# EAGLE design DualNixie (EAGLE 7.4.0)
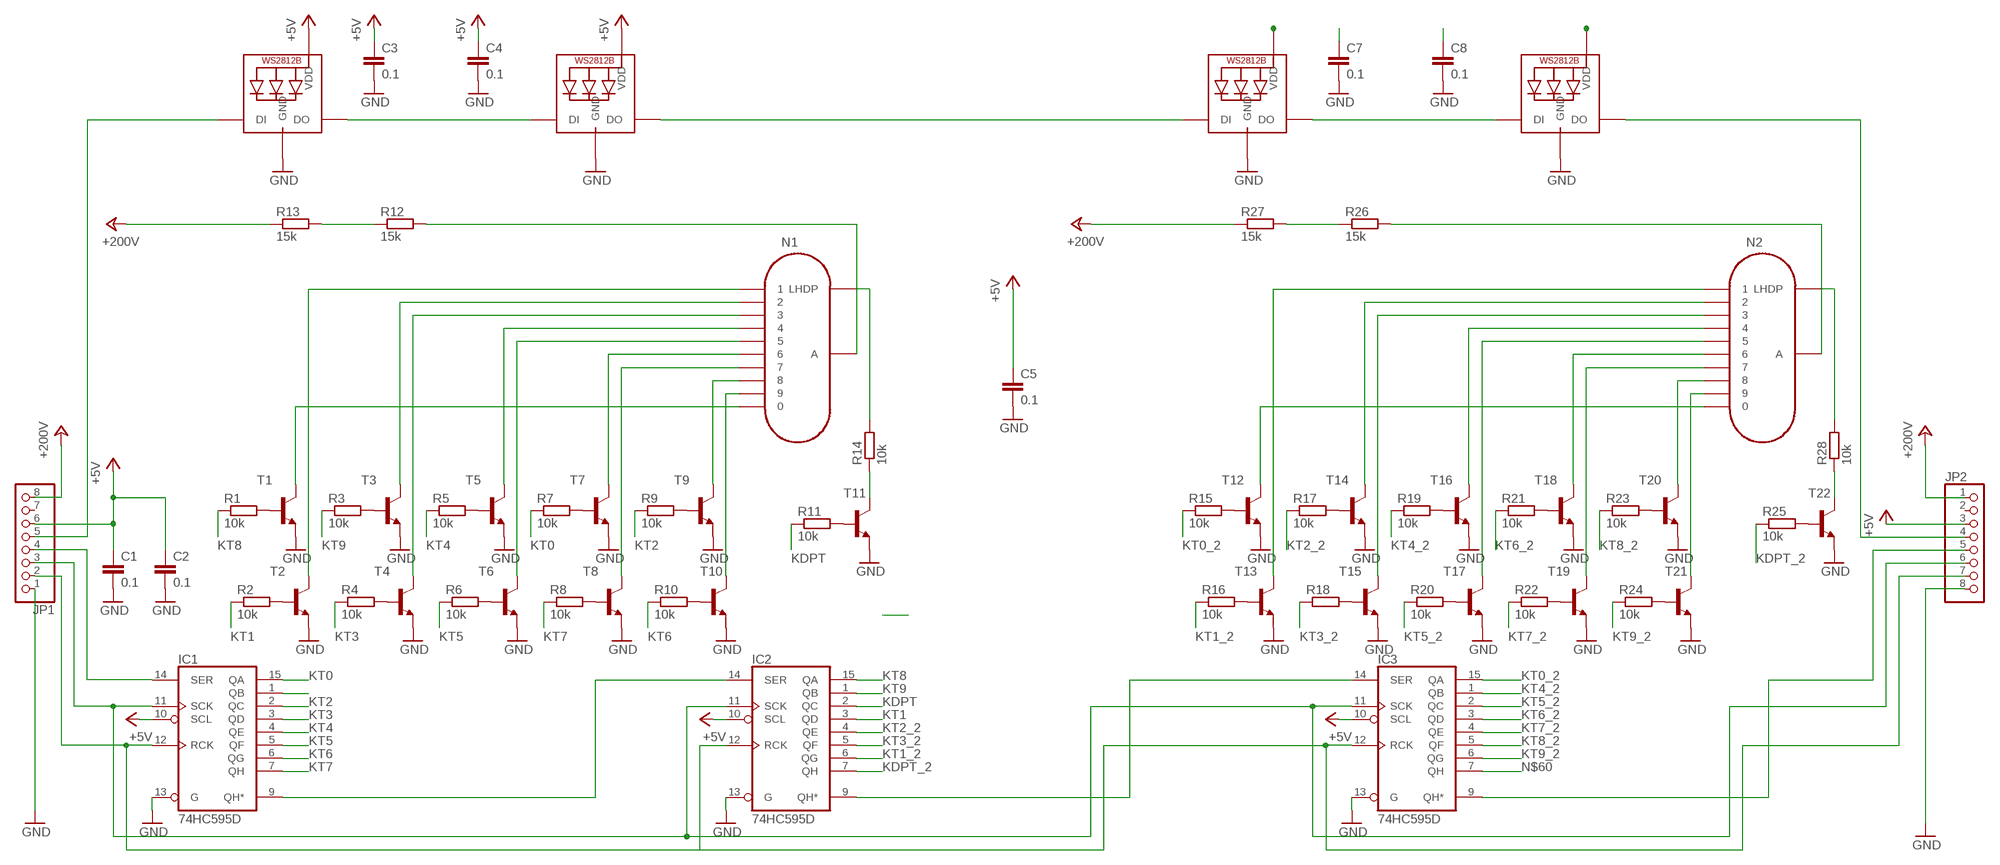
[diagram p0: schematic, sheet 1]

## Parts
C1  0.1  C-EUC0805  [C0805]
C2  0.1  C-EUC0805  [C0805]
C3  0.1  C-EUC0805  [C0805]
C4  0.1  C-EUC0805  [C0805]
C5  0.1  C-EUC0805  [C0805]
C7  0.1  C-EUC0805  [C0805]
C8  0.1  C-EUC0805  [C0805]
IC1  74HC595D  [SO16]
IC2  74HC595D  [SO16]
IC3  74HC595D  [SO16]
JP1  HEADER-1X8ROUND  [1X08_ROUND]
JP2  HEADER-1X8ROUND  [1X08_ROUND]
LED1  WS2812B3535  [LED3535]
LED2  WS2812B3535  [LED3535]
LED3  WS2812B3535  [LED3535]
LED4  WS2812B3535  [LED3535]
N1  IN-12B1.5MM  [IN-12-1.5]
N2  IN-12B1.5MM  [IN-12-1.5]
R1  10k  R-EU_R0805  [R0805]
R2  10k  R-EU_R0805  [R0805]
R3  10k  R-EU_R0805  [R0805]
R4  10k  R-EU_R0805  [R0805]
R5  10k  R-EU_R0805  [R0805]
R6  10k  R-EU_R0805  [R0805]
R7  10k  R-EU_R0805  [R0805]
R8  10k  R-EU_R0805  [R0805]
R9  10k  R-EU_R0805  [R0805]
R10  10k  R-EU_R0805  [R0805]
R11  10k  R-EU_R0805  [R0805]
R12  15k  R-EU_R0805  [R0805]
R13  15k  R-EU_R0805  [R0805]
R14  10k  R-EU_R0805  [R0805]
R15  10k  R-EU_R0805  [R0805]
R16  10k  R-EU_R0805  [R0805]
R17  10k  R-EU_R0805  [R0805]
R18  10k  R-EU_R0805  [R0805]
R19  10k  R-EU_R0805  [R0805]
R20  10k  R-EU_R0805  [R0805]
R21  10k  R-EU_R0805  [R0805]
R22  10k  R-EU_R0805  [R0805]
R23  10k  R-EU_R0805  [R0805]
R24  10k  R-EU_R0805  [R0805]
R25  10k  R-EU_R0805  [R0805]
R26  15k  R-EU_R0805  [R0805]
R27  15k  R-EU_R0805  [R0805]
R28  10k  R-EU_R0805  [R0805]
T1  MMBTA42LT1-NPN-SOT23-BEC  [SOT23-BEC]
T2  MMBTA42LT1-NPN-SOT23-BEC  [SOT23-BEC]
T3  MMBTA42LT1-NPN-SOT23-BEC  [SOT23-BEC]
T4  MMBTA42LT1-NPN-SOT23-BEC  [SOT23-BEC]
T5  MMBTA42LT1-NPN-SOT23-BEC  [SOT23-BEC]
T6  MMBTA42LT1-NPN-SOT23-BEC  [SOT23-BEC]
T7  MMBTA42LT1-NPN-SOT23-BEC  [SOT23-BEC]
T8  MMBTA42LT1-NPN-SOT23-BEC  [SOT23-BEC]
T9  MMBTA42LT1-NPN-SOT23-BEC  [SOT23-BEC]
T10  MMBTA42LT1-NPN-SOT23-BEC  [SOT23-BEC]
T11  MMBTA42LT1-NPN-SOT23-BEC  [SOT23-BEC]
T12  MMBTA42LT1-NPN-SOT23-BEC  [SOT23-BEC]
T13  MMBTA42LT1-NPN-SOT23-BEC  [SOT23-BEC]
T14  MMBTA42LT1-NPN-SOT23-BEC  [SOT23-BEC]
T15  MMBTA42LT1-NPN-SOT23-BEC  [SOT23-BEC]
T16  MMBTA42LT1-NPN-SOT23-BEC  [SOT23-BEC]
T17  MMBTA42LT1-NPN-SOT23-BEC  [SOT23-BEC]
T18  MMBTA42LT1-NPN-SOT23-BEC  [SOT23-BEC]
T19  MMBTA42LT1-NPN-SOT23-BEC  [SOT23-BEC]
T20  MMBTA42LT1-NPN-SOT23-BEC  [SOT23-BEC]
T21  MMBTA42LT1-NPN-SOT23-BEC  [SOT23-BEC]
T22  MMBTA42LT1-NPN-SOT23-BEC  [SOT23-BEC]

## Nets
+5V [+5V]: C1.1 C2.1 C3.1 C4.1 C5.1 C7.1 C8.1 IC1.10(SCL) IC2.10(SCL) IC3.10(SCL) JP1.6 JP2.3 LED1.2(VDD) LED2.2(VDD) LED3.2(VDD) LED4.2(VDD)
+200V [+200V]: JP1.8 JP2.1 R13.1 R27.1
ANODE [+200V]: N1.A R12.2
ANODE1 [+200V]: N2.A R26.2
GND: C1.2 C2.2 C3.2 C4.2 C5.2 C7.2 C8.2 IC1.13(G) IC2.13(G) IC3.13(G) JP1.1 JP2.8 LED1.4(GND) LED2.4(GND) LED3.4(GND) LED4.4(GND) T1.E T2.E T3.E T4.E T5.E T6.E T7.E T8.E T9.E T10.E T11.E T12.E T13.E T14.E T15.E T16.E T17.E T18.E T19.E T20.E T21.E T22.E
K0 [+200V]: N1.0 T1.C
K1 [+200V]: N1.1 T2.C
K2 [+5V]: N1.2 T3.C
K3 [+200V]: N1.3 T4.C
K4 [+200V]: N1.4 T5.C
K5 [+200V]: N1.5 T6.C
K6: N1.6 T7.C
K7 [+200V]: N1.7 T8.C
K8 [+200V]: N1.8 T9.C
K9 [+200V]: N1.9 T10.C
K10 [+200V]: N2.0 T12.C
K11 [+200V]: N2.1 T13.C
K12 [+200V]: N2.2 T14.C
K13 [+200V]: N2.3 T15.C
K14 [+200V]: N2.4 T16.C
K15 [+200V]: N2.5 T17.C
K16 [+200V]: N2.6 T18.C
K17 [+200V]: N2.7 T19.C
K18 [+200V]: N2.8 T20.C
K19 [+200V]: N2.9 T21.C
KDP [+200V]: N1.LHDP R14.2
KDP1 [+200V]: N2.LHDP R28.2
KDPT: IC2.2(QC) R11.1
KDPT_2: IC2.7(QH) R25.1
KT0: IC1.15(QA) R7.1
KT0_2: IC3.15(QA) R15.1
KT1: IC2.3(QD) R2.1
KT1_2: IC2.6(QG) R16.1
KT2: IC1.2(QC) R9.1
KT2_2: IC2.4(QE) R17.1
KT3: IC1.3(QD) R4.1
KT3_2: IC2.5(QF) R18.1
KT4: IC1.4(QE) R5.1
KT4_2: IC3.1(QB) R19.1
KT5: IC1.5(QF) R6.1
KT5_2: IC3.2(QC) R20.1
KT6: IC1.6(QG) R10.1
KT6_2: IC3.3(QD) R21.1
KT7: IC1.7(QH) R8.1
KT7_2: IC3.4(QE) R22.1
KT8: IC2.15(QA) R1.1
KT8_2: IC3.5(QF) R23.1
KT9: IC2.1(QB) R3.1
KT9_2: IC3.6(QG) R24.1
N$1: R3.2 T3.B
N$2: R1.2 T1.B
N$3: R2.2 T2.B
N$4: R4.2 T4.B
N$5: R5.2 T5.B
N$6: R6.2 T6.B
N$7: R7.2 T7.B
N$8: R8.2 T8.B
N$9: R9.2 T9.B
N$10: R10.2 T10.B
N$11: LED1.3(DO) LED2.1(DI)
N$12: JP1.5 LED1.1(DI)
N$13: LED2.3(DO) LED3.1(DI)
N$14: R15.2 T12.B
N$15: R16.2 T13.B
N$16: R17.2 T14.B
N$17: R18.2 T15.B
N$18: R19.2 T16.B
N$19: R20.2 T17.B
N$20: R21.2 T18.B
N$21: R11.2 T11.B
N$22: IC1.14(SER) JP1.4
N$23 [+200V]: R14.1 T11.C
N$24 [+200V]: R12.1 R13.2
N$25: IC1.9(QH*) IC2.14(SER)
N$26: IC1.11(SCK) IC2.11(SCK) IC3.11(SCK) JP1.3 JP2.6
N$27: IC1.1(QB)
N$28: IC2.9(QH*) IC3.14(SER)
N$29: R22.2 T19.B
N$30: R23.2 T20.B
N$31: R24.2 T21.B
N$32: R25.2 T22.B
N$33 [+200V]: R28.1 T22.C
N$34 [+200V]: R26.1 R27.2
N$35: IC1.12(RCK) IC2.12(RCK) IC3.12(RCK) JP1.2 JP2.7
N$36: IC3.9(QH*) JP2.5
N$40: LED3.3(DO) LED4.1(DI)
N$42: JP2.4 LED4.3(DO)
N$60: IC3.7(QH)
Unconnected: JP1.7 JP2.2

## Power pins joined to a net without a drawn wire
+5V: IC1.16(VCC) IC2.16(VCC) IC3.16(VCC)
GND: IC1.8(GND) IC2.8(GND) IC3.8(GND)

## Library data of the parts
C1-C5 C7 C8 = rcl:C-EU: CAPACITOR, European symbol
IC1-IC3 = 74xx-eu:74*595: 8-bit SHIFT REGISTER, output latch
JP1 JP2 = Adafruit CP2104:HEADER-1X8: PIN HEADER
LED1-LED4 = adafruit:WS2812B
N1 N2 = russian-nixies:IN-12B: IN-12B: medium numeric topview nixie tube
R1-R28 = resistor:R-EU_: RESISTOR, European symbol
T1-T22 = transistor-neu-to92:*-NPN-: NPN Transistror

## Net classes
0 default: width 0.203 mm, drill 0.61 mm, clearance 0.203 mm
1 +5V: width 0.406 mm, drill 0.61 mm, clearance 0.203 mm
2 +200V: width 0.254 mm, drill 0.61 mm, clearance 0.406 mm

## Board
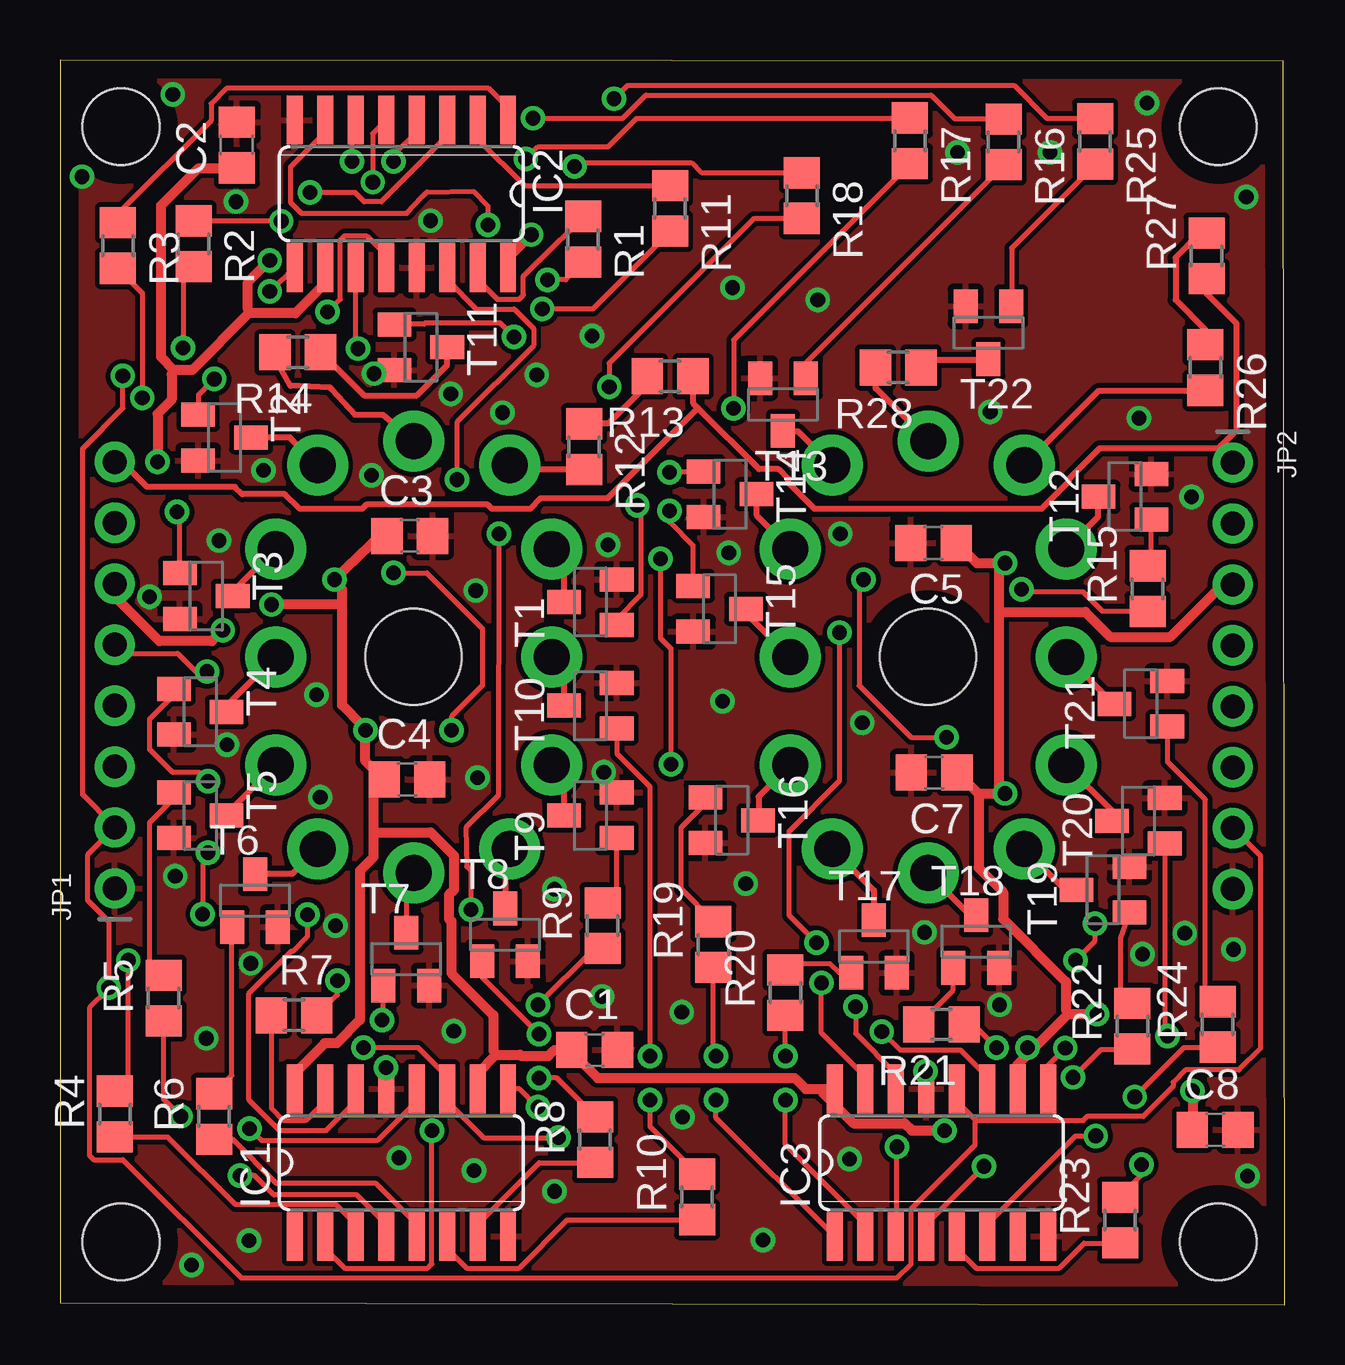
[diagram p1: board, top side]
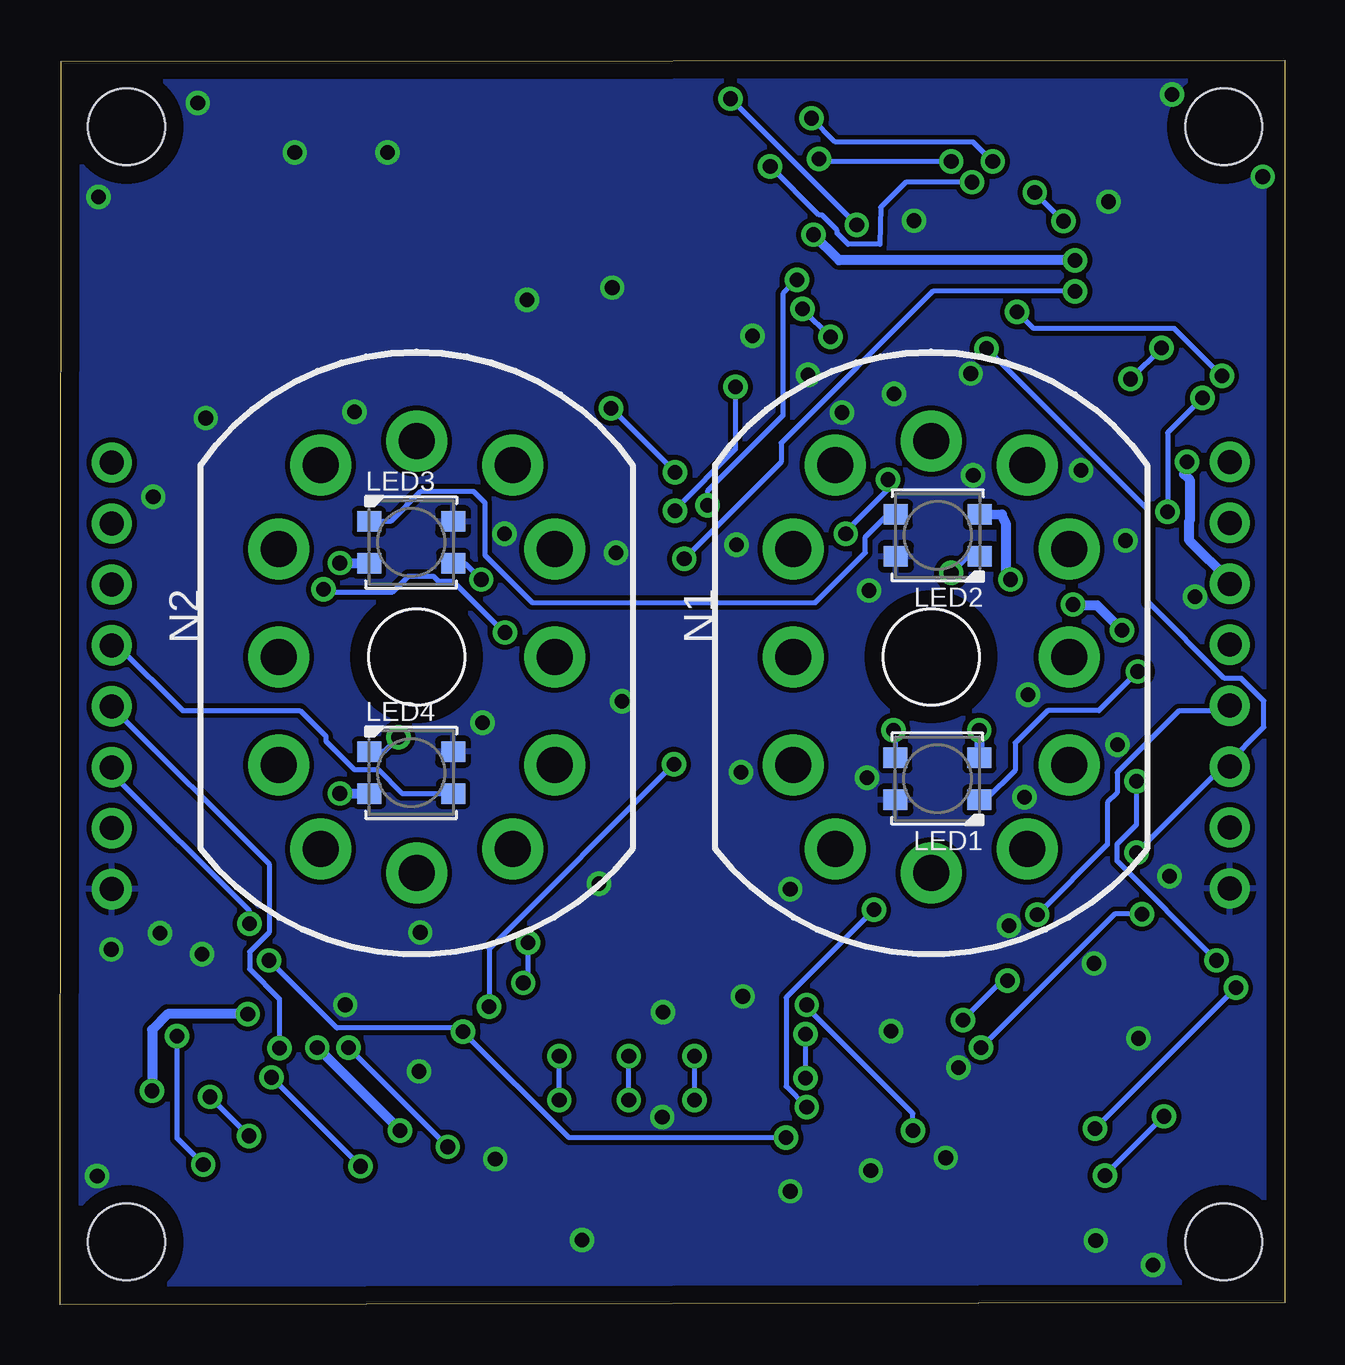
[diagram p2: board, bottom side, seen from below]

Size 51.03 x 51.88 mm. Coordinates in mm from the lower left corner, seen from the top.
Outline: 0,0.08 51.03,0 50.98,51.83 0,51.88 0,0.08
Copper layers (1*16): Top 0.035mm / dielectric 1.5mm / Bottom 0.035mm
Design rules "default *": minimum track width 8mil, minimum drill 24mil, track to track 8mil, track to pad 8mil, pad to pad 8mil, via to via 8mil, smd to smd 8mil, copper to edge 30mil, drill to drill 8mil, minimum pad ring 10mil, minimum via ring 8mil, stop-mask expansion 4mil, vias tented up to drill 0mil, thermal gap 10mil
Holes 3.2 mm at 2.54,2.62 48.26,2.62 48.26,49.1 2.54,49.1

### Footprints (pad centres in the part's own frame; a part is rotated, then mirrored left to right if it is on the bottom)
C0805 = smd 1.3 x 1.5: 1 -0.95,0; 2 0.95,0
SO16 = smd 0.66 x 2.032: 1 -4.445,-3.073; 2 -3.175,-3.073; 3 -1.905,-3.073; 4 -0.635,-3.073; 5 0.635,-3.073; 6 1.905,-3.073; 7 3.175,-3.073; 8 4.445,-3.073; 9 4.445,3.073; 10 3.175,3.073; 11 1.905,3.073; 12 0.635,3.073; 13 -0.635,3.073; 14 -1.905,3.073; 15 -3.175,3.073; 16 -4.445,3.073
1X08_ROUND = drill 1 pad 1.676: 1 -8.89,0; 2 -6.35,0; 3 -3.81,0; 4 -1.27,0; 5 1.27,0; 6 3.81,0; 7 6.35,0; 8 8.89,0
LED3535 = smd 1 x 0.85: 1 -1.75,0.875; 2 -1.75,-0.875; 3 1.75,-0.875; 4 1.75,0.875
IN-12-1.5 = drill 1.5 pad 2.54: 0 5.75,-4.5; 1 -4,-8; 2 -5.75,-4.5; 3 -5.75,0; 4 -5.75,4.5; 5 -4,8; 6 0,9; 7 4,8; 8 5.75,4.5; 9 5.75,0; A 4,-8; LHDP 0,-9 | hole 4: 0,0
R0805 = smd 1.3 x 1.5: 1 -0.95,0; 2 0.95,0
SOT23-BEC = smd 1 x 1.4: B -0.95,-1.1; C 0,1.1; E 0.95,-1.1

### Placement (x,y rotation side)
C1  22.28,10.62 0 top
C2  7.37,48.34 90 top
C3  14.57,32.05 0 top
C4  14.46,21.89 0 top
C5  36.4,31.75 180 top
C7  36.42,22.17 180 top
C8  48.13,7.29 0 top
IC1  14.22,5.92 0 top
IC2  14.22,46.3 180 top
IC3  36.73,5.92 0 top
JP1  2.29,26.24 90 top
JP2  48.87,26.21 270 top
LED1  14.47,21.92 180 bottom
LED2  14.45,32.07 180 bottom
LED3  36.4,31.78 0 bottom
LED4  36.4,22.17 0 bottom
N1  14.73,27 180 bottom
N2  36.17,27 180 bottom
R1  21.8,44.41 270 top
R2  5.56,44.22 270 top
R3  2.41,44.15 270 top
R4  2.29,7.95 90 top
R5  4.32,12.78 90 top
R6  6.43,7.85 90 top
R7  9.75,12.06 0 top
R8  22.3,6.88 90 top
R9  22.61,15.8 90 top
R10  26.54,4.5 90 top
R11  25.43,45.69 270 top
R12  21.84,35.76 270 top
R13  25.42,38.7 180 top
R14  9.91,39.7 180 top
R15  45.31,29.84 90 top
R16  39.32,48.46 270 top
R17  35.41,48.51 270 top
R18  30.91,46.23 270 top
R19  27.23,15.01 90 top
R20  30.23,13 90 top
R21  36.73,11.68 180 top
R22  44.68,11.61 90 top
R23  44.17,3.53 90 top
R24  48.23,11.68 90 top
R25  43.13,48.49 270 top
R26  47.73,39.07 270 top
R27  47.78,43.71 90 top
R28  34.92,39.07 180 top
T1  22.1,29.29 90 top
T2  6.86,36.14 270 top
T3  6.1,29.54 270 top
T4  5.84,24.71 270 top
T5  5.84,20.4 270 top
T6  8.13,16.84 0 top
T7  14.43,14.4 0 top
T8  18.54,15.42 0 top
T9  22.1,20.4 90 top
T10  22.1,24.97 90 top
T11  15.04,39.9 270 top
T12  44.37,33.68 90 top
T13  30.12,37.52 180 top
T14  27.91,33.78 270 top
T15  27.48,29.01 270 top
T16  27.99,20.19 270 top
T17  33.91,14.94 0 top
T18  38.18,15.14 0 top
T19  43.46,17.3 90 top
T20  44.93,20.17 90 top
T21  45.03,25.04 90 top
T22  38.68,40.51 180 top

### Tracks (layer width: path | path; a pad name or v marks a point on that pad's centre or on a via)
+5V  (via drill 0.61)
  Top 0.406: v47.19,8.92 47.19,7.29 C8.1 | 42.01,12.12 v43.2,12.12 | 40.48,10.58 39.9,10.01 IC3.10 | 40.48,10.58 42.01,12.12 | C5.1 37.36,31.75 38.2,30.91 v39.37,30.91 39.14,30.73 39.14,28.88 | 38.28,21.31 38.25,21.31 37.39,22.17 C7.1 | 38.28,21.31 v39.37,21.31 39.14,21.49 39.14,28.88 | JP2.3 48.44,30.02 46.25,27.84 43.76,27.84 42.72,28.88 39.14,28.88 | 38.28,21.31 38.28,18.21 39.29,17.2 39.29,16.08 41.91,13.46 41.91,12.29 42.01,12.12 | 4.75,38.96 4.22,39.5 4.22,45.82 5.77,47.37 7.37,47.37 C2.1 | 4.75,38.96 5.51,38.96 7.87,41.33 | 7.87,41.33 9.8,41.33 11.05,42.57 IC2.10 | IC2.16 18.67,43.64 v19.63,44.6 | v8.74,43.54 7.82,42.62 7.82,41.5 7.87,41.33 | v4.06,35.13 4.06,37.14 4.65,37.72 4.65,38.79 4.75,38.96 | 18.16,10.41 19.18,10.41 19.23,10.36 20.34,10.36 20.6,10.62 C1.1 21.41,10.44 22.4,9.45 30.61,9.45 31.06,8.99 31.8,8.99 | 18.16,10.41 17.4,9.65 IC1.10 | 31.8,8.99 IC3.16 | C3.1 13.41,32.13 v11.43,30.23 11.76,29.82 11.76,29.18 | IC1.16 9.78,9.65 11.02,10.9 11.53,10.9 12.5,11.86 12.5,18.09 13.06,18.64 13.06,19.69 | 13.06,19.69 13.06,22.05 C4.1 13.49,21.9 12.72,22.66 v12.72,23.95 12.62,24.13 11.76,24.99 11.76,29.18 | 13.06,19.69 15.44,19.69 16.41,18.72 16.41,17.3 16.2,17.09 16.2,16.08 16.31,15.98 16.31,13.82 18.06,12.07 18.06,10.59 18.16,10.41 | JP1.6 2.29,29.52 4.14,27.66 6.33,27.66 v6.78,28.12 | 11.76,29.18 v8.81,29.18 | v40.31,10.72 40.34,10.72 40.48,10.58 | v36.85,7.26 35.48,7.26 35.18,7.57 33.05,7.57 31.8,8.81 31.8,8.99
  Bottom 0.406: v47.19,8.92 47.19,11.46 46.53,12.12 v43.2,12.12 | v39.37,30.91 38.15,30.91 LED3.2 | v39.37,21.31 38.15,21.31 LED4.2 | v19.63,44.6 18.57,43.54 v8.74,43.54 | JP1.6 2.29,30.18 3.99,31.88 3.99,32.64 3.96,32.66 3.96,34.39 4.19,34.62 4.19,35 v4.06,35.13 | v11.43,30.23 11.61,30.4 11.61,32.54 11.79,32.94 12.7,32.92 LED2.2 | v12.72,23.95 12.72,22.81 LED1.2 | v6.78,28.12 7.82,29.16 8.79,29.16 v8.81,29.18 | v36.85,7.26 v40.31,10.72
+200V
  Top 0.254: 26.58,37.38 29.13,34.82 29.95,34.82 30.35,34.42 30.35,34.26 31.45,33.17 40.89,33.17 42.04,34.32 42.04,34.42 43.31,35.69 48.28,35.69 | 26.58,37.38 26.39,37.57 26.39,38.68 R13.1 | JP2.1 48.28,35.69 | R27.1 47.78,42.14 49.02,40.89 49.02,36.45 48.36,35.79 48.28,35.69 | JP1.8 2.59,35.13 3.63,34.09 7.29,34.09 7.59,33.78 9.37,33.78 10.01,33.17 12.57,33.17 12.75,33.35 17.83,33.35 18.01,33.17 19.58,33.17 20.02,33.6 22.81,33.6 26.58,37.38
ANODE
  Top 0.254: R12.2 21.82,34.82 18.9,34.82 18.75,34.98 N1.A
ANODE1
  Top 0.254: R26.2 47.73,38.1 43.28,38.1 40.18,35 N2.A
GND  (via drill 0.61)
  other vias: 29.29,2.69 20.6,4.72 17.25,5.59 14.12,6.12 7.87,2.67 6.1,11.1 4.8,17.86 49.48,5.36 32.89,6.07 49.43,46.18 45.29,50.09 41.25,48.03 37.39,48.03 38.76,37.21 31.57,41.88 28.02,42.39 27.61,25.15 33.43,24.26 28.57,17.55 45.11,14.61 44.96,36.96 36.02,15.52 39.14,12.5 22.58,12.85 25.91,12.19 25.93,7.82 16.41,11.4 20.6,17.32 17.32,29.77 16.28,37.97 19.86,38.76 18.44,37.19 22.83,31.67 27.86,31.34 22.66,22.2 13.59,9.88 7.95,14.22 11.48,15.8 4.7,50.44 0.91,47.02 7.34,45.97 8.48,34.77 6.63,31.85 3.73,29.51 10.69,25.43 10.85,21.16 6.96,23.34 17.4,21.97 5.49,1.65 48.9,14.81 46.86,15.49 32.51,32.13 36.07,9.73 13.08,38.81 22.17,40.39 12.98,34.57 15.44,45.19 47.14,33.68
  pour Bottom: 0.25,0.33 50.88,0.23 50.88,51.54 0.25,51.64
  pour Top: 0.47,0.56 50.79,0.6 50.86,51.25 0.38,51.45 0.36,0.79
K0
  Top 0.254: T1.C 20.98,29.29 20.98,31.01 20.5,31.5 N1.0
K1
  Top 0.254: T2.C 9.58,36.14 10.72,35 N1.1
K2
  Top 0.254: T3.C 7.21,29.54 7.21,29.74 8.97,31.5 N1.2
K3
  Top 0.254: T4.C 6.96,24.71 6.96,24.99 8.97,27 N1.3
K4
  Top 0.254: T5.C 6.96,20.4 6.96,20.47 8.97,22.48 N1.4
K5
  Top 0.254: T6.C 8.13,17.96 9.68,17.96 10.72,19 N1.5
K6
  Top 0.203: T7.C 14.43,17.68 14.73,17.98 N1.6
K7
  Top 0.254: T8.C 18.54,18.82 N1.7
K8
  Top 0.254: T9.C 20.98,20.4 20.98,22 20.5,22.48 N1.8
K9
  Top 0.254: T10.C 20.98,24.97 20.98,26.52 20.5,27 N1.9
K10
  Top 0.254: T12.C 43.26,33.68 43.26,32.84 41.94,31.52 N2.0
K11
  Top 0.254: T13.C 30.12,36.4 30.76,36.4 32.16,35 N2.1
K12
  Top 0.254: T14.C 29.03,33.78 29.03,32.89 30.4,31.52 N2.2
K13
  Top 0.254: T15.C 28.6,29.01 28.6,28.8 30.4,27 N2.3
K14
  Top 0.254: T16.C 29.11,20.19 29.11,21.18 30.4,22.48 N2.4
K15
  Top 0.254: T17.C 33.91,17.27 32.18,19 N2.5
K16
  Top 0.254: T18.C 38.18,16.26 37.9,16.26 36.17,17.98 N2.6
K17
  Top 0.254: T19.C 41.88,17.3 40.18,19 N2.7
K18
  Top 0.254: T20.C 43.81,20.17 43.81,20.6 41.94,22.48 N2.8
K19
  Top 0.254: N2.9 41.96,27 43.92,25.04 T21.C
KDP
  Top 0.254: R14.2 8.97,39.42 9.6,38.3 11.25,38.23 11.33,38.15 12.29,37.08 13.46,37.08 14.73,36.02 N1.LHDP
KDP1
  Top 0.254: R28.2 33.98,39.07 33.98,38.2 36.17,36.02 N2.LHDP
KDPT
  Top 0.203: IC2.2 17.4,48.59 19.36,46.63 25.43,46.63 R11.1
KDPT_2  (via drill 0.61)
  Top 0.203: v23.09,50.27 23.65,50.83 39.75,50.83 41.12,49.45 43.13,49.45 R25.1 | v17.83,45.01 17.83,45.8 17.22,46.41 15.29,46.38 15.09,46.18 14.45,45.49 10.06,45.49 9.6,45.95 9.6,47.42 11.05,48.87 IC2.7
  Bottom 0.203: v17.83,45.01 v23.09,50.27
KT0
  Top 0.203: IC1.15 11.05,8.48 10.24,7.67 9.32,7.67 8.81,8.18 8.81,12.07 R7.1
KT0_2  (via drill 0.61)
  Top 0.203: v40.06,29.82 40.16,29.72 42.62,29.72 43.43,28.91 R15.1 | v32.49,28.02 32.49,21.84 30.38,19.74 30.38,16.23 v31.52,15.09 | v31.73,13.41 31.73,11.33 33.55,9.5 IC3.15
  Bottom 0.203: v40.06,29.82 39.93,29.69 37.19,29.69 36.52,30.35 35.46,30.35 35.26,30.15 34.65,30.15 32.51,28.02 v32.49,28.02 | v31.52,15.09 31.52,13.61 v31.73,13.41
KT1  (via drill 0.61)
  Top 0.203: v9.22,45.16 5.56,45.16 R2.1 | v10.41,46.36 12.29,46.36 12.68,45.97 13.39,45.97 16.13,48.72 IC2.3
  Bottom 0.203: v10.41,46.36 v9.22,45.16
KT1_2  (via drill 0.61)
  Top 0.203: v19.71,49.45 23.44,49.45 24.41,50.42 36.3,50.42 37.29,49.43 39.32,49.43 R16.1 | v12.17,47.65 12.17,49.23 IC2.6
  Bottom 0.203: v19.71,49.45 18.72,48.46 12.98,48.46 v12.17,47.65
KT2  (via drill 0.61)
  Top 0.203: v19.91,12.5 22.25,14.83 22.61,14.83 R9.1 | v15.49,7.26 15.49,1.7 15.32,1.52 11.86,1.52 11.05,2.34 IC1.2
  Bottom 0.203: v19.91,12.5 19.91,12.4 15.49,7.98 v15.49,7.26
KT2_2  (via drill 0.61)
  Top 0.203: v19.41,47.75 19.91,48.26 22.84,48.26 24.03,49.45 35.41,49.45 R17.1 | v13.89,47.65 13.89,47.9 14.86,48.87 IC2.4
  Bottom 0.203: v19.41,47.75 19.3,47.65 v13.89,47.65
KT3
  Top 0.203: IC1.3 12.32,3.35 11.51,4.17 7.32,4.17 4.5,6.99 R4.1
KT3_2  (via drill 0.61)
  Top 0.203: v21.44,47.45 21.59,47.6 26.31,47.6 26.72,47.19 30.91,47.19 R18.1 | v13.03,46.79 13.03,48.82 IC2.5
  Bottom 0.203: v21.44,47.45 19.41,45.42 19.28,45.42 18.64,44.78 18.64,44.65 18.19,44.2 16.87,44.2 16.84,45.75 15.8,46.79 v13.03,46.79
KT4  (via drill 0.61)
  Top 0.203: R5.1 4.32,8.56 v5.03,7.85 | v7.49,5.39 8.1,5.39 8.91,4.57 12.37,4.57 13.59,3.35 IC1.4
  Bottom 0.203: v7.49,5.39 v5.03,7.85
KT4_2  (via drill 0.61)
  Top 0.203: R19.1 27.23,10.47 v27.33,10.36 | v27.33,8.53 27.33,7.8 IC3.1
  Bottom 0.203: v27.33,8.53 v27.33,10.36
KT5
  Top 0.203: IC1.5 14.86,3.35 13.16,5.05 9.02,5.05 7.19,6.88 6.43,6.88 R6.1
KT5_2  (via drill 0.61)
  Top 0.203: v30.23,10.36 R20.1 | v30.23,8.53 30.23,6.68 33.55,3.35 IC3.2
  Bottom 0.203: v30.23,8.53 v30.23,10.36
KT6
  Top 0.203: IC1.6 16.13,2.34 16.94,1.52 19.13,1.52 21.13,3.53 26.54,3.53 R10.1
KT6_2  (via drill 0.61)
  Top 0.203: R21.1 38.05,11.68 v39.01,10.72 | v34.87,6.58 34.87,2.9 IC3.3
  Bottom 0.203: v34.87,6.58 v39.01,10.72
KT7
  Top 0.203: IC1.7 17.4,3.35 19.96,5.92 22.3,5.92 R8.1
KT7_2  (via drill 0.61)
  Top 0.203: v42.22,9.47 43.38,10.64 44.68,10.64 R22.1 | v38.51,5.77 36.09,3.35 IC3.4
  Bottom 0.203: v38.51,5.77 v42.22,9.47
KT8
  Top 0.203: IC2.15 17.4,42.72 18.21,41.91 19.13,41.91 19.3,42.09 19.3,42.88 19.96,43.54 19.99,43.54 21.79,45.34 R1.1
KT8_2
  Top 0.203: IC3.5 37.36,2.34 38.18,1.52 41.63,1.52 42.67,2.57 44.17,2.57 R23.1
KT9
  Top 0.203: R3.1 2.41,45.47 6.3,49.35 6.3,50.06 6.93,50.7 17.86,50.7 18.67,49.89 IC2.1
KT9_2  (via drill 0.61)
  Top 0.203: v44.78,8.66 46.84,10.72 48.23,10.72 R24.1 | v43.16,7.04 42.32,7.04 38.63,3.35 IC3.6
  Bottom 0.203: v43.16,7.04 v44.78,8.66
N$1  (via drill 0.61)
  Top 0.203: v4.88,33.05 4.98,32.94 4.98,30.51 T3.B | v3.43,37.8 3.43,42.16 2.41,43.18 R3.2
  Bottom 0.203: v4.88,33.05 4.88,36.35 v3.43,37.8
N$2  (via drill 0.61)
  Top 0.203: v24.05,33.33 24.21,33.17 24.21,29.59 23.22,28.6 23.22,28.35 T1.B | v20.32,42.72 21.08,42.72 21.79,43.43 R1.2
  Bottom 0.203: v24.05,33.33 24.05,33.91 20.9,37.06 20.9,42.14 v20.32,42.72
N$3  (via drill 0.61)
  Top 0.203: v6.43,38.58 5.77,37.92 5.77,37.11 T2.B | v5.13,39.88 5.13,42.82 5.56,43.26 R2.2
  Bottom 0.203: v5.13,39.88 v6.43,38.58
N$4  (via drill 0.61)
  Top 0.203: v6.17,21.82 5.82,22.17 4.7,22.17 3.73,23.14 3.73,24.41 4.72,25.4 4.72,25.65 T4.B | v2.85,14.35 2.85,9.47 2.29,8.92 R4.2
  Bottom 0.203: v6.17,21.82 6.17,20.02 6.99,19.2 6.99,18.49 v2.85,14.35
N$5
  Top 0.203: T5.B 4.72,21.34 4.72,21.08 3.73,20.09 3.73,14.33 4.32,13.74 R5.2
N$6
  Top 0.203: T6.B 7.16,15.72 7.16,9.55 6.43,8.81 R6.2
N$7  (via drill 0.61)
  Top 0.203: v13.41,11.86 13.46,11.91 13.46,13.28 T7.B | v11.56,13.51 11.56,12.9 10.72,12.07 R7.2
  Bottom 0.203: v13.41,11.86 11.76,13.51 v11.56,13.51
N$8  (via drill 0.61)
  Top 0.203: v19.96,11.28 17.6,13.64 17.6,14.3 T8.B | v19.96,9.45 20.7,9.45 22.3,7.85 R8.2
  Bottom 0.203: v19.96,9.45 v19.96,11.28
N$9
  Top 0.203: T9.B 23.19,19.43 23.19,17.35 22.61,16.76 R9.2
N$10  (via drill 0.61)
  Top 0.203: v24.59,10.36 24.59,21.59 23.22,22.96 23.22,24 T10.B | v24.59,8.53 24.59,7.42 26.54,5.46 R10.2
  Bottom 0.203: v24.59,8.53 v24.59,10.36
N$11  (via drill 0.61)
  Top 0.203: v16.31,23.95 16.31,24.51 17.6,25.81 17.6,28.19 15.29,30.51 v13.89,30.51
  Bottom 0.203: v16.31,23.95 16.23,23.88 16.23,22.81 LED1.3 | v13.89,30.51 13.23,31.17 12.72,31.17 LED2.1
N$12  (via drill 0.61)
  Top 0.203: v6.12,26.39 5.66,26.39 4.9,27.15 2.64,27.15 JP1.5
  Bottom 0.203: v6.12,26.39 7.75,24.77 9.88,24.77 11.23,23.42 11.23,22.28 12.45,21.06 12.7,21.06 LED1.1
N$13
  Bottom 0.203: LED2.3 16.2,32.92 16.56,32.92 17.48,32 17.48,31.34 19.56,29.26 31.34,29.26 33.33,31.24 33.33,33.43 33.81,33.91 35.99,33.91 37.24,32.66 38.12,32.66 LED3.1
N$14
  Top 0.203: T12.B 45.47,30.96 45.31,30.81 R15.2
N$15
  Top 0.203: T13.B 31.09,38.63 31.09,39.27 39.32,47.5 R16.2
N$16  (via drill 0.61)
  Top 0.203: v25.4,34.7 25.43,34.72 26.8,34.72 T14.B | v28.07,37.36 28.07,40.21 35.41,47.55 R17.2
  Bottom 0.203: v28.07,37.36 v25.4,34.7
N$17  (via drill 0.61)
  Top 0.203: v25.4,33.1 25.4,32.61 26.36,31.65 26.36,29.97 T15.B | v22.89,38.25 22.89,39.24 28.91,45.26 30.91,45.26 R18.2
  Bottom 0.203: v25.4,33.1 25.4,33.15 22.89,35.66 v22.89,38.25
N$18
  Top 0.203: T16.B 26.87,21.13 26.87,20.88 25.88,19.89 25.88,17.32 R19.2
N$19
  Top 0.203: T17.B 32.94,13.84 32.46,13.84 32.08,14.22 30.48,14.22 30.23,13.97 R20.2
N$20
  Top 0.203: T18.B 37.21,14.02 37.21,13.11 R21.2
N$21  (via drill 0.61)
  Top 0.203: v18.92,40.34 18.34,40.92 15.21,40.92 15.16,40.87 13.95,40.87 T11.B | v20.09,41.5 22.2,41.5 25.43,44.73 R11.2
  Bottom 0.203: v20.09,41.5 v18.92,40.34
N$22  (via drill 0.61)
  Top 0.203: IC1.14 12.32,8.48 11.1,7.26 9.14,7.26 7.85,8.56 7.85,12.95 9.63,14.73 9.7,14.73 10.31,15.34 v10.31,16.26
  Bottom 0.203: v10.31,16.26 7.39,19.18 7.39,20.93 6.99,21.34 6.99,22.17 4.42,24.74 2.52,24.74 JP1.4
N$23
  Top 0.254: T11.C 16.13,39.17 14.86,37.9 12.68,37.9 10.87,39.7 R14.1
N$24
  Top 0.254: R12.1 21.84,36.73 22.84,36.73 24.46,38.35 24.46,38.68 R13.2
N$25  (via drill 0.61)
  Top 0.203: IC1.9 19.15,8.99 v19.91,8.23 | v17.12,16.46 17.12,18.09 16.94,18.26 16.92,19.89 18.26,21.23 v18.29,32.13 | v16.54,34.39 16.54,36.78 19.74,39.98 19.74,40.69 18.92,41.5 17.35,41.5 16.13,42.72 IC2.14
  Bottom 0.203: v19.91,8.23 20.78,9.09 20.78,12.8 v17.12,16.46 | v18.29,32.13 18.29,32.23 16.54,33.99 v16.54,34.39
N$26  (via drill 0.61)
  Top 0.203: v12.65,10.72 14.91,10.72 16.13,9.5 IC1.11 16.18,8.92 16.18,8.43 17.65,6.96 v20.78,6.96 | v5.94,16.28 5.94,18.62 v6.17,18.85 | IC3.11 38.63,9.5 37.52,10.62 35,10.62 v34.24,11.38 | IC2.11 12.32,39.95 v12.42,39.85 | v43.13,15.88 43.13,15.16 v42.32,14.35
  Bottom 0.203: v12.65,10.72 7.09,16.28 v5.94,16.28 | v6.17,18.85 2.59,22.43 JP1.3 2.44,22.5 0.86,24.08 0.86,25.17 1.8,26.11 2.52,26.11 5.69,29.29 5.69,33.12 v12.42,39.85 | v20.78,6.96 29.82,6.96 v34.24,11.38 34.31,11.43 34.42,11.53 39.5,11.53 v42.32,14.35 | JP2.6 48.87,22.15 43.13,16.41 v43.13,15.88
N$28  (via drill 0.61)
  Top 0.203: IC3.14 34.82,9.63 33.15,11.3 v33.15,12.42 | v25.45,22.53 25.45,27.36 25.02,27.79 v25.02,31.09 | v8.74,42.24 8.79,42.24 IC2.9
  Bottom 0.203: v33.15,12.42 33.15,14.83 v25.45,22.53 | v25.02,31.09 20.98,35.13 20.98,35.92 14.66,42.24 v8.74,42.24
N$29
  Top 0.203: T19.B 44.58,16.33 44.2,15.29 44.2,13.06 44.68,12.57 R22.2
N$30  (via drill 0.61)
  Top 0.203: v46.15,11.2 46.05,11.3 46.05,19.2 T20.B | v45.06,5.84 45.06,5.39 44.17,4.5 R23.2
  Bottom 0.203: v46.15,11.2 46.15,6.93 v45.06,5.84
N$31
  Top 0.203: T21.B 46.15,24.08 46.15,22.63 47.73,21.06 47.73,13.16 48.23,12.65 R24.2
N$32
  Top 0.203: T22.B 39.65,41.63 39.65,44.04 43.13,47.52 R25.2
N$33
  Top 0.254: T22.C 38.68,39.4 36.22,39.4 R28.1
N$34
  Top 0.254: R26.1 47.73,40.64 46.48,41.88 46.48,43.64 47.5,44.65 47.78,44.65 R27.2
N$35  (via drill 0.61)
  Top 0.203: IC3.12 37.36,8.48 38.18,7.67 | 38.18,7.67 42.62,7.67 42.8,7.85 45.14,7.85 46.38,9.09 46.38,9.27 46.89,9.78 49.12,9.78 50.01,10.67 50.01,18.72 JP2.7 | IC1.12 14.86,8.48 13.23,6.86 8.38,6.86 v7.9,7.34 | IC2.12 13.59,43.74 12.78,44.55 11.86,44.55 11.68,44.37 11.68,41.91 v11.15,41.38 | v2.62,38.71 2.62,37.36 0.94,35.69 0.94,21.26 2.23,19.96 JP1.2 1.14,18.75 1.14,16.87 2.03,15.98 v2.03,13.21 1.98,13.13 1.22,12.37 1.22,6.22 1.4,6.05 2.62,6.05 7.54,1.12 34.87,1.12 35.46,1.7 35.46,3.99 38.12,6.66 38.12,7.59 38.18,7.67
  Bottom 0.203: v2.03,13.21 v7.9,7.34 | v11.15,41.38 10.46,40.69 4.6,40.69 v2.62,38.71
N$36  (via drill 0.61)
  Top 0.203: IC3.9 41.17,9.98 v41.88,10.69
  Bottom 0.203: v41.88,10.69 41.88,12.75 43.13,14 43.13,14.71 42.32,15.52 42.32,18.36 48.87,24.92 JP2.5
N$40  (via drill 0.61)
  Top 0.203: v36.93,23.65 35.46,23.65 33.3,25.81 33.3,30.05 v33.48,30.23
  Bottom 0.203: v36.93,23.65 37.52,23.06 38.12,23.06 LED4.1 | v33.48,30.23 34.14,30.89 LED3.3
N$42
  Bottom 0.203: JP2.4 48.64,27.48 45.92,24.77 41.02,24.77 39.95,23.7 39.95,23.5 38.76,22.3 37.77,22.3 36.78,21.31 34.67,21.31 LED4.3